# EAGLE design synth (EAGLE 7.2.0)
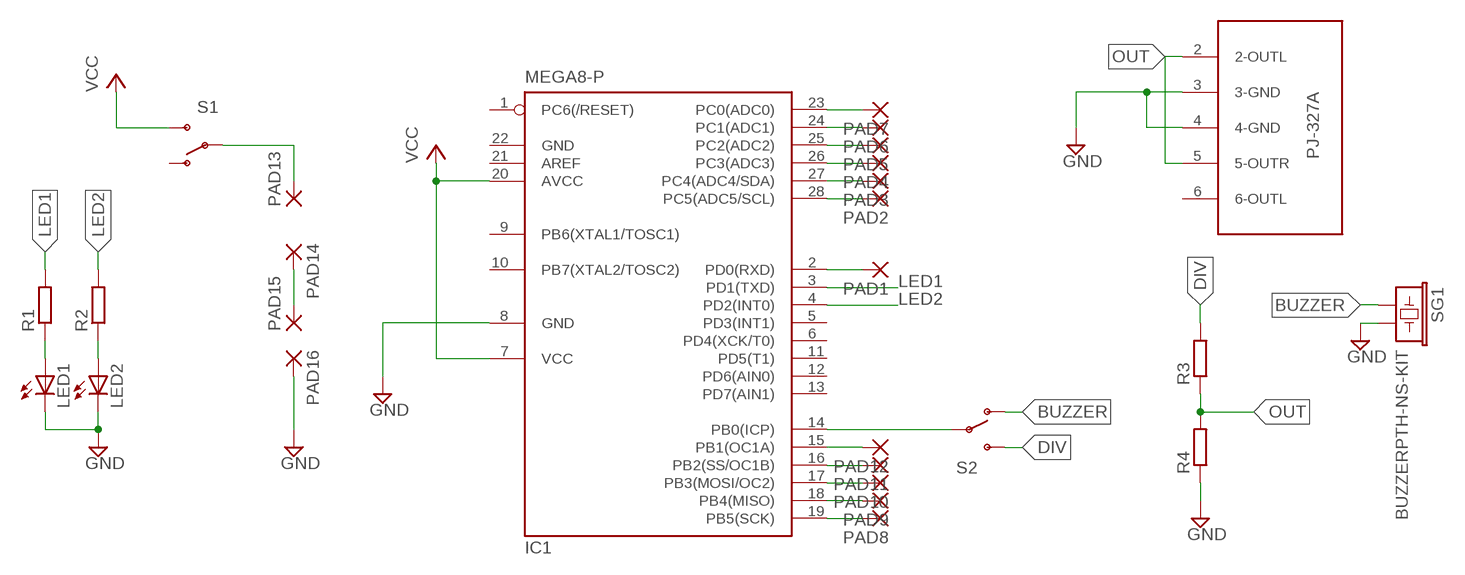
[diagram p0: schematic, sheet 1]

## Parts
IC1  MEGA8-P  [DIL28-3]
LED1  LEDSML0805  [SML0805]
LED2  LEDSML0805  [SML0805]
PAD1  SMD2  [SMD1,27-2,54]
PAD2  SMD2  [SMD1,27-2,54]
PAD3  SMD2  [SMD1,27-2,54]
PAD4  SMD2  [SMD1,27-2,54]
PAD5  SMD2  [SMD1,27-2,54]
PAD6  SMD2  [SMD1,27-2,54]
PAD7  SMD2  [SMD1,27-2,54]
PAD8  SMD2  [SMD1,27-2,54]
PAD9  SMD2  [SMD1,27-2,54]
PAD10  SMD2  [SMD1,27-2,54]
PAD11  SMD2  [SMD1,27-2,54]
PAD12  SMD2  [SMD1,27-2,54]
PAD13  2,54/1,1  [2,54/1,1]
PAD14  2,54/1,1  [2,54/1,1]
PAD15  2,54/1,1  [2,54/1,1]
PAD16  2,54/1,1  [2,54/1,1]
R1  R-EU_R0805  [R0805]
R2  R-EU_R0805  [R0805]
R3  R-EU_R0805  [R0805]
R4  R-EU_R0805  [R0805]
S1  SWITCH-SPDTPTH  [SWITCH-SPDT]
S2  SWITCH-SPDTPTH  [SWITCH-SPDT]
SG1  BUZZERPTH-NS-KIT  [BUZZER-12MM-NS-KIT]
U$1  PJ-327A  [PJ-327A]

## Nets
BUZZER: S2.1(O) SG1.+
DIV: R3.2 S2.3(S)
GND: IC1.8(GND) LED1.C LED2.C PAD16.1(P) R4.1 SG1.- U$1.3(3-GND) U$1.4(4-GND)
LED1: IC1.3(PD1(TXD)) R1.2
LED2: IC1.4(PD2(INT0)) R2.2
N$1: LED1.A R1.1
N$2: PAD14.1(P) PAD15.1(P)
N$3: LED2.A R2.1
N$4: PAD13.1(P) S1.2(P)
N$5: IC1.14(PB0(ICP)) S2.2(P)
OUT: R3.1 R4.2 U$1.2(2-OUTL) U$1.5(5-OUTR)
PAD1: IC1.2(PD0(RXD)) PAD1.1(P)
PAD2: IC1.28(PC5(ADC5/SCL)) PAD2.1(P)
PAD3: IC1.27(PC4(ADC4/SDA)) PAD3.1(P)
PAD4: IC1.26(PC3(ADC3)) PAD4.1(P)
PAD5: IC1.25(PC2(ADC2)) PAD5.1(P)
PAD6: IC1.24(PC1(ADC1)) PAD6.1(P)
PAD7: IC1.23(PC0(ADC0)) PAD7.1(P)
PAD8: IC1.19(PB5(SCK)) PAD8.1(P)
PAD9: IC1.18(PB4(MISO)) PAD9.1(P)
PAD10: IC1.17(PB3(MOSI/OC2)) PAD10.1(P)
PAD11: IC1.16(PB2(SS/OC1B)) PAD11.1(P)
PAD12: IC1.15(PB1(OC1A)) PAD12.1(P)
VCC: IC1.7(VCC) IC1.20(AVCC) S1.3(S)
Unconnected: IC1.1(PC6(/RESET)) IC1.5(PD3(INT1)) IC1.6(PD4(XCK/T0)) IC1.9(PB6(XTAL1/TOSC1)) IC1.10(PB7(XTAL2/TOSC2)) IC1.11(PD5(T1)) IC1.12(PD6(AIN0)) IC1.13(PD7(AIN1)) IC1.21(AREF) S1.1(O) U$1.6(6-OUTL)

## Power pins joined to a net without a drawn wire
GND: IC1.22(GND)

## Library data of the parts
IC1 = atmel:MEGA8-P: MICROCONTROLLER 8 Kbytes FLASH, 1 kbytes SRAM, 512 bytes EEPROM, USART, 4-channel 10 bit ADC, 2-channel 8 bit ADC Pin compatible with Atmega48, ATMega88, ATMega168 Source: avr.lbr; OC_FARNELL: unknown; OC_NEWARK: unknown
LED1 LED2 = led:LED: LED OSRAM: - CHIPLED LG R971, LG N971, LY N971, LG Q971, LY Q971, LO R971, LY R971 LH N974, LH R974 LS Q976, LO Q976, LY Q976 LO Q996 - Hyper CHIPLED LW Q18S LB Q993, LB Q99A, LB R99A - SideLED LS A670, LO A670, LY A670, LG A670, LP A670 LB A673, LV A673, LT A673, LW A673 LH A674 LY A675 LS A676, LA A676, LO A676, LY A676, LW A676 LS A679, LY A679, LG A679 - Hyper Micro SIDELED® LS Y876, LA Y876, LO Y876, LY Y876 LT Y87S - SmartLED LW L88C, LW L88S LB L89C, LB L89S, LG L890 LS L89K, LO L89K, LY L89K LS L896, LA L896, LO L896, LY L896 - TOPLED LS T670, LO T670, LY T670, LG T670, LP T670 LSG T670, LSP T670, LSY T670, LOP T670, LYG T670 LG T671, LOG T671, LSG T671 LB T673, LV T673, LT T673, LW T673 LH T674 LS T676, LA T676, LO T676, LY T676, LB T676, LH T676, LSB T676, LW T676 LB T67C, LV T67C, LT T67C, LS T67K, LO T67K, LY T67K, LW E67C LS E67B, LA E67B, LO E67B, LY E67B, LB E67C, LV E67C, LT E67C LW T67C LS T679, LY T679, LG T679 LS T770, LO T770, LY T770, LG T770, LP T770 LB T773, LV T773, LT T773, LW T773 LH T774 LS E675, LA E675, LY E675, LS T675 LS T776, LA T776, LO T776, LY T776, LB T776 LHGB T686 LT T68C, LB T68C - Hyper Mini TOPLED® LB M676 - Mini TOPLED Santana® LG M470 LS M47K, LO M47K, LY M47K Source: http://www.osram.convergy.de LUXEON: - LUMILED® LXK2-PW12-R00, LXK2-PW12-S00, LXK2-PW14-U00, LXK2-PW14-V00 LXK2-PM12-R00, LXK2-PM12-S00, LXK2-PM14-U00 LXK2-PE12-Q00, LXK2-PE12-R00, LXK2-PE12-S00, LXK2-PE14-T00, LXK2-PE14-U00 LXK2-PB12-K00, LXK2-PB12-L00, LXK2-PB12-M00, LXK2-PB14-N00, LXK2-PB14-P00, LXK2-PB14-Q00 LXK2-PR12-L00, LXK2-PR12-M00, LXK2-PR14-Q00, LXK2-PR14-R00 LXK2-PD12-Q00, LXK2-PD12-R00, LXK2-PD12-S00 LXK2-PH12-R00, LXK2-PH12-S00 LXK2-PL12-P00, LXK2-PL12-Q00, LXK2-PL12-R00 Source: www.luxeon.com KINGBRIGHT: KA-3528ASYC Source: www.kingbright.com
PAD1-PAD12 = wirepad:SMD2: SMD PAD
PAD13-PAD16 = wirepad:2,54/1,1: THROUGH-HOLE PAD
R1-R4 = rcl:R-EU_: RESISTOR, European symbol
S1 S2 = SparkFun-Electromechanical:SWITCH-SPDT: SPDT Switch Simple slide switch, Spark Fun Electronics SKU : COM-00102 DPDT SMT slide switch, AYZ0202, SWCH-08179; PROD_ID: SWCH-08261
SG1 = SparkFun-Electromechanical:BUZZER: Buzzer 12mm Spark Fun Electronics SKU : Comp-Buzzer; PROD_ID: COMP-08253
U$1 = PJ-327A:PJ-327A

## Board
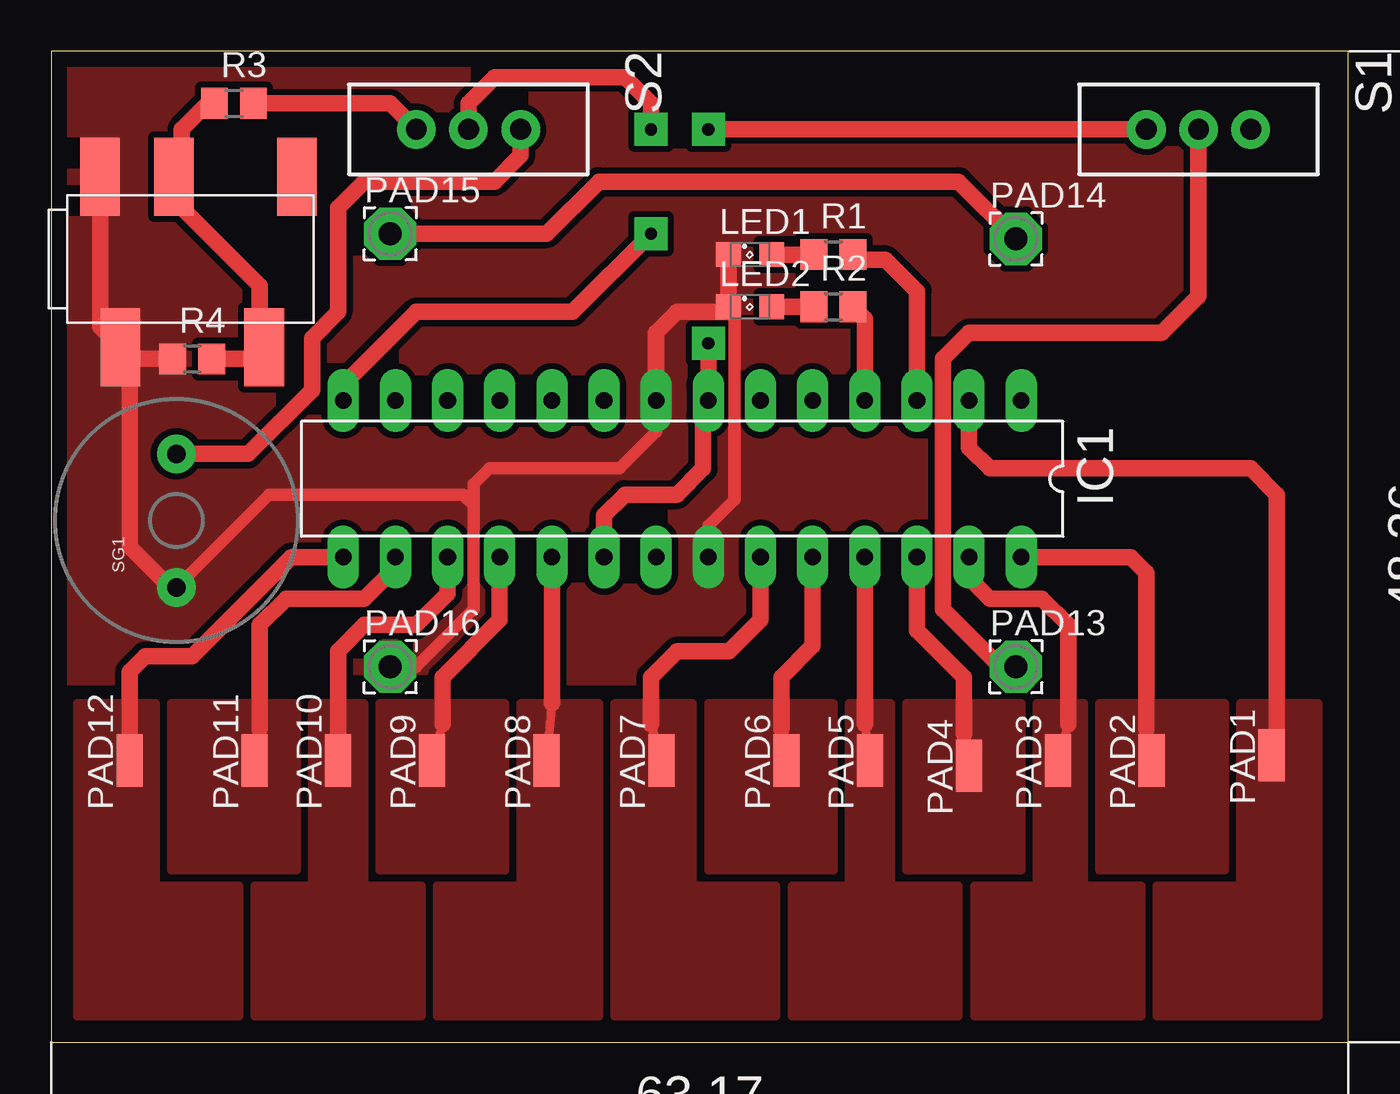
[diagram p1: board, top side]
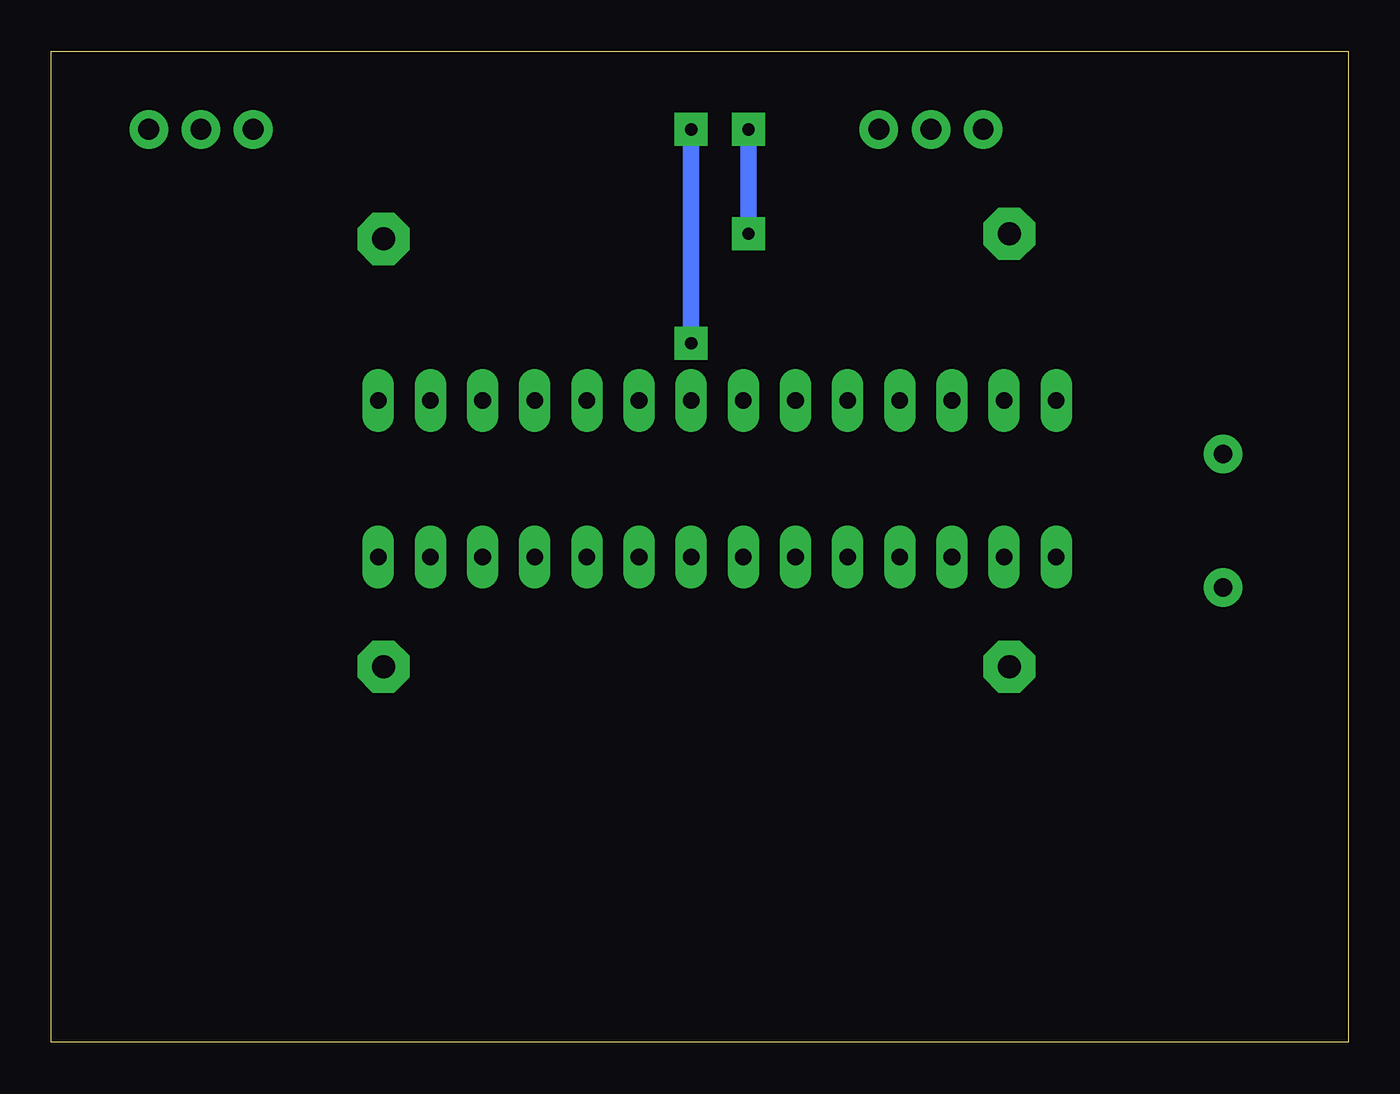
[diagram p2: board, bottom side, seen from below]

Size 63.17 x 48.25 mm. Coordinates in mm from the lower left corner, seen from the top.
Outline: 0,0 63.17,0 63.17,48.25 0,48.25 0,0
Copper layers (1*16): Top 0.035mm / dielectric 1.5mm / Bottom 0.035mm
Design rules "default *": minimum track width 10mil, minimum drill 24mil, track to track 12mil, track to pad 12mil, pad to pad 8mil, via to via 8mil, smd to smd 12mil, copper to edge 30mil, drill to drill 8mil, minimum pad ring 14mil, minimum via ring 20mil, stop-mask expansion 4mil, vias tented up to drill 0mil, thermal gap 0mil

### Footprints (pad centres in the part's own frame; a part is rotated, then mirrored left to right if it is on the bottom)
DIL28-3 = drill 0.813 long: 1 -16.51,-3.81; 2 -13.97,-3.81; 3 -11.43,-3.81; 4 -8.89,-3.81; 5 -6.35,-3.81; 6 -3.81,-3.81; 7 -1.27,-3.81; 8 1.27,-3.81; 9 3.81,-3.81; 10 6.35,-3.81; 11 8.89,-3.81; 12 11.43,-3.81; 13 13.97,-3.81; 14 16.51,-3.81; 15 16.51,3.81; 16 13.97,3.81; 17 11.43,3.81; 18 8.89,3.81; 19 6.35,3.81; 20 3.81,3.81; 21 1.27,3.81; 22 -1.27,3.81; 23 -3.81,3.81; 24 -6.35,3.81; 25 -8.89,3.81; 26 -11.43,3.81; 27 -13.97,3.81; 28 -16.51,3.81
SML0805 = smd 1.2 x 1.2: A 1.05,0; C -1.05,0
SMD1,27-2,54 = smd 1.27 x 2.54: 1 0,0
2,54/1,1 = drill 1.118 pad 2.54 octagon: 1 0,0
R0805 = smd 1.3 x 1.5: 1 -0.95,0; 2 0.95,0
SWITCH-SPDT = drill 1.016 pad 1.88: 1 0,2.54; 2 0,0; 3 0,-2.54
BUZZER-12MM-NS-KIT = drill 0.9 pad 1.88: + 3.25,0; - -3.25,0
PJ-327A = smd 1.93 x 3.81: 2 9.1,-6.8; 3 2.1,-6.8; 4 1.1,1.5; 5 4.7,1.5; 6 10.7,1.5

### Placement (x,y rotation side)
IC1  30.73,27.43 180 top
LED1  34.04,38.35 0 top
LED2  34.04,35.81 0 top
PAD1  59.44,13.97 0 top
PAD2  53.59,13.72 0 top
PAD3  49.02,13.72 0 top
PAD4  44.7,13.46 0 top
PAD5  39.88,13.72 0 top
PAD6  35.81,13.72 0 top
PAD7  29.72,13.72 0 top
PAD8  24.13,13.72 0 top
PAD9  18.54,13.72 0 top
PAD10  13.97,13.72 0 top
PAD11  9.91,13.72 0 top
PAD12  3.81,13.72 0 top
PAD13  46.99,18.29 0 top
PAD14  46.99,39.12 0 top
PAD15  16.51,39.37 0 top
PAD16  16.51,18.29 0 top
R1  38.1,38.35 0 top
R2  38.1,35.81 0 top
R3  8.89,45.72 0 top
R4  6.86,33.27 0 top
S1  55.88,44.45 270 top
S2  20.32,44.45 270 top
SG1  6.1,25.4 90 top
U$1  1.27,40.64 0 top

### Tracks (layer width: path | path; a pad name or v marks a point on that pad's centre or on a via)
BUZZER
  Top 0.813: S2.1 22.86,43.18 21.59,41.91 15.24,41.91 13.97,40.64 13.97,35.56 12.7,34.29 12.7,31.75 9.6,28.65 SG1.+
DIV
  Top 0.813: R3.2 16.51,45.72 S2.3
GND
  Top 0.406: 30.48,35.56 33.02,35.56 | 33.27,35.53 LED2.C
  Top 0.61: PAD16.1 17.78,18.29 20.57,21.08 20.57,26.16 | 20.57,26.16 20.07,26.67 10.62,26.67 SG1.- | IC1.22 32,25.15 33.27,26.42 33.27,35.53 | 20.57,26.16 20.57,27.18 21.34,27.94 27.69,27.94 29.46,29.72 IC1.8
  Top 0.813: LED1.C LED2.C 32.73,35.56 30.48,35.56 29.46,34.54 IC1.8 | U$1.4 2.37,34.84 U$1.3 3.94,33.27 | R4.1 3.94,33.27 | SG1.- 5.79,22.15 3.81,24.13 3.81,33.15 3.94,33.27
  pour Top: 0.25,48.26 63.25,48.26 63.25,17.78 0.25,17.78
LED1
  Top 0.813: IC1.3 42.16,36.58 40.64,38.1 39.3,38.1 R1.2
LED2
  Top 0.813: IC1.4 39.62,35.24 R2.2
N$1
  Top 0.813: LED1.A R1.1
N$2
  Top 0.813: PAD15.1 24.13,39.37 26.67,41.91 44.2,41.91 PAD14.1
N$3
  Top 0.813: LED2.A R2.1
N$4
  Top 0.813: PAD13.1 46.23,18.29 43.43,21.08 43.43,33.27 44.7,34.54 54.1,34.54 55.88,36.32 S1.2
N$5  (via drill 0.6 pad 1.27)
  Top 0.813: IC1.14 14.22,32 17.78,35.56 25.4,35.56 v29.21,39.37 | v29.21,44.45 29.21,45.72 27.94,46.99 21.59,46.99 20.32,45.72 S2.2
  Bottom 0.813: v29.21,39.37 v29.21,44.45
OUT
  Top 0.813: R3.1 7.62,45.72 6.35,44.45 6.35,42.52 U$1.5 5.97,41.02 10.16,36.83 10.16,34.05 U$1.2 9.8,33.27 R4.2
PAD1
  Top 0.813: IC1.2 44.7,28.96 45.72,27.94 58.42,27.94 59.69,26.67 59.69,14.22 PAD1.1
  pour Top: 53.85,7.62 57.91,7.62 57.91,16.51 61.72,16.51 61.72,1.27 53.85,1.27
PAD2
  Top 0.406: 53.34,15.24 PAD2.1
  Top 0.813: IC1.28 52.58,23.62 53.34,22.86 53.34,15.24
  pour Top: 51.05,16.51 51.05,8.38 57.15,8.38 57.15,16.51
PAD3
  Top 0.406: 49.53,15.49 PAD3.1
  Top 0.813: IC1.27 44.7,22.61 45.72,21.59 48.26,21.59 49.53,20.32 49.53,15.49
  pour Top: 44.96,7.62 48.01,7.62 48.01,16.51 50.29,16.51 50.29,7.62 53.09,7.62 53.09,1.27 44.96,1.27
PAD4
  Top 0.406: 44.45,14.99 PAD4.1
  Top 0.813: IC1.26 42.16,20.07 44.45,17.78 44.45,14.99
  pour Top: 41.66,16.51 41.66,8.38 47.24,8.38 47.24,16.51
PAD5
  Top 0.406: 39.62,15.49 PAD5.1
  Top 0.813: IC1.25 39.62,15.49
  pour Top: 36.07,7.62 38.86,7.62 38.86,16.51 40.89,16.51 40.89,7.62 44.2,7.62 44.2,1.27 36.07,1.27
PAD6
  Top 0.406: 35.56,15.24 PAD6.1
  Top 0.813: IC1.24 37.08,19.3 35.56,17.78 35.56,15.24
  pour Top: 32,16.51 38.1,16.51 38.1,8.38 32,8.38
PAD7
  Top 0.406: 29.21,15.49 PAD7.1
  Top 0.813: IC1.23 34.54,20.57 33.02,19.05 30.48,19.05 29.21,17.78 29.21,15.49
  pour Top: 27.43,1.27 27.43,16.51 31.24,16.51 31.24,7.62 35.31,7.62 35.31,1.27
PAD8
  Top 0.406: 24.38,16.51 PAD8.1
  Top 0.813: IC1.19 24.38,16.51
  pour Top: 18.8,7.62 22.86,7.62 22.86,16.51 26.67,16.51 26.67,1.27 18.8,1.27
PAD9
  Top 0.406: 19.05,15.49 PAD9.1
  Top 0.813: IC1.18 21.84,20.57 19.05,17.78 19.05,15.49
  pour Top: 16,16.51 16,8.38 22.1,8.38 22.1,16.51
PAD10
  Top 0.813: IC1.17 19.3,21.84 17.78,20.32 15.24,20.32 13.97,19.05 PAD10.1
  pour Top: 9.91,7.62 12.7,7.62 12.7,16.51 15.24,16.51 15.24,7.62 18.03,7.62 18.03,1.27 9.91,1.27
PAD11
  Top 0.406: 10.16,15.24 PAD11.1
  Top 0.813: IC1.16 16.76,23.11 15.24,21.59 11.43,21.59 10.16,20.32 10.16,15.24
  pour Top: 5.84,16.51 5.84,8.38 11.94,8.38 11.94,16.51
PAD12
  Top 0.813: IC1.15 11.68,23.62 6.86,18.8 4.57,18.8 3.81,18.03 PAD12.1
  pour Top: 1.27,1.27 1.27,16.51 5.08,16.51 5.08,7.62 9.14,7.62 9.14,1.27
VCC  (via drill 0.6 pad 1.27)
  Top 0.813: IC1.20 26.92,25.65 27.94,26.67 30.48,26.67 31.75,27.94 31.75,30.99 IC1.7 v32,34.04 | S1.3 v32,44.45
  Bottom 0.813: v32,44.45 v32,34.04